# EasyEDA Pro project 智能水杯垫.epro, board 方形
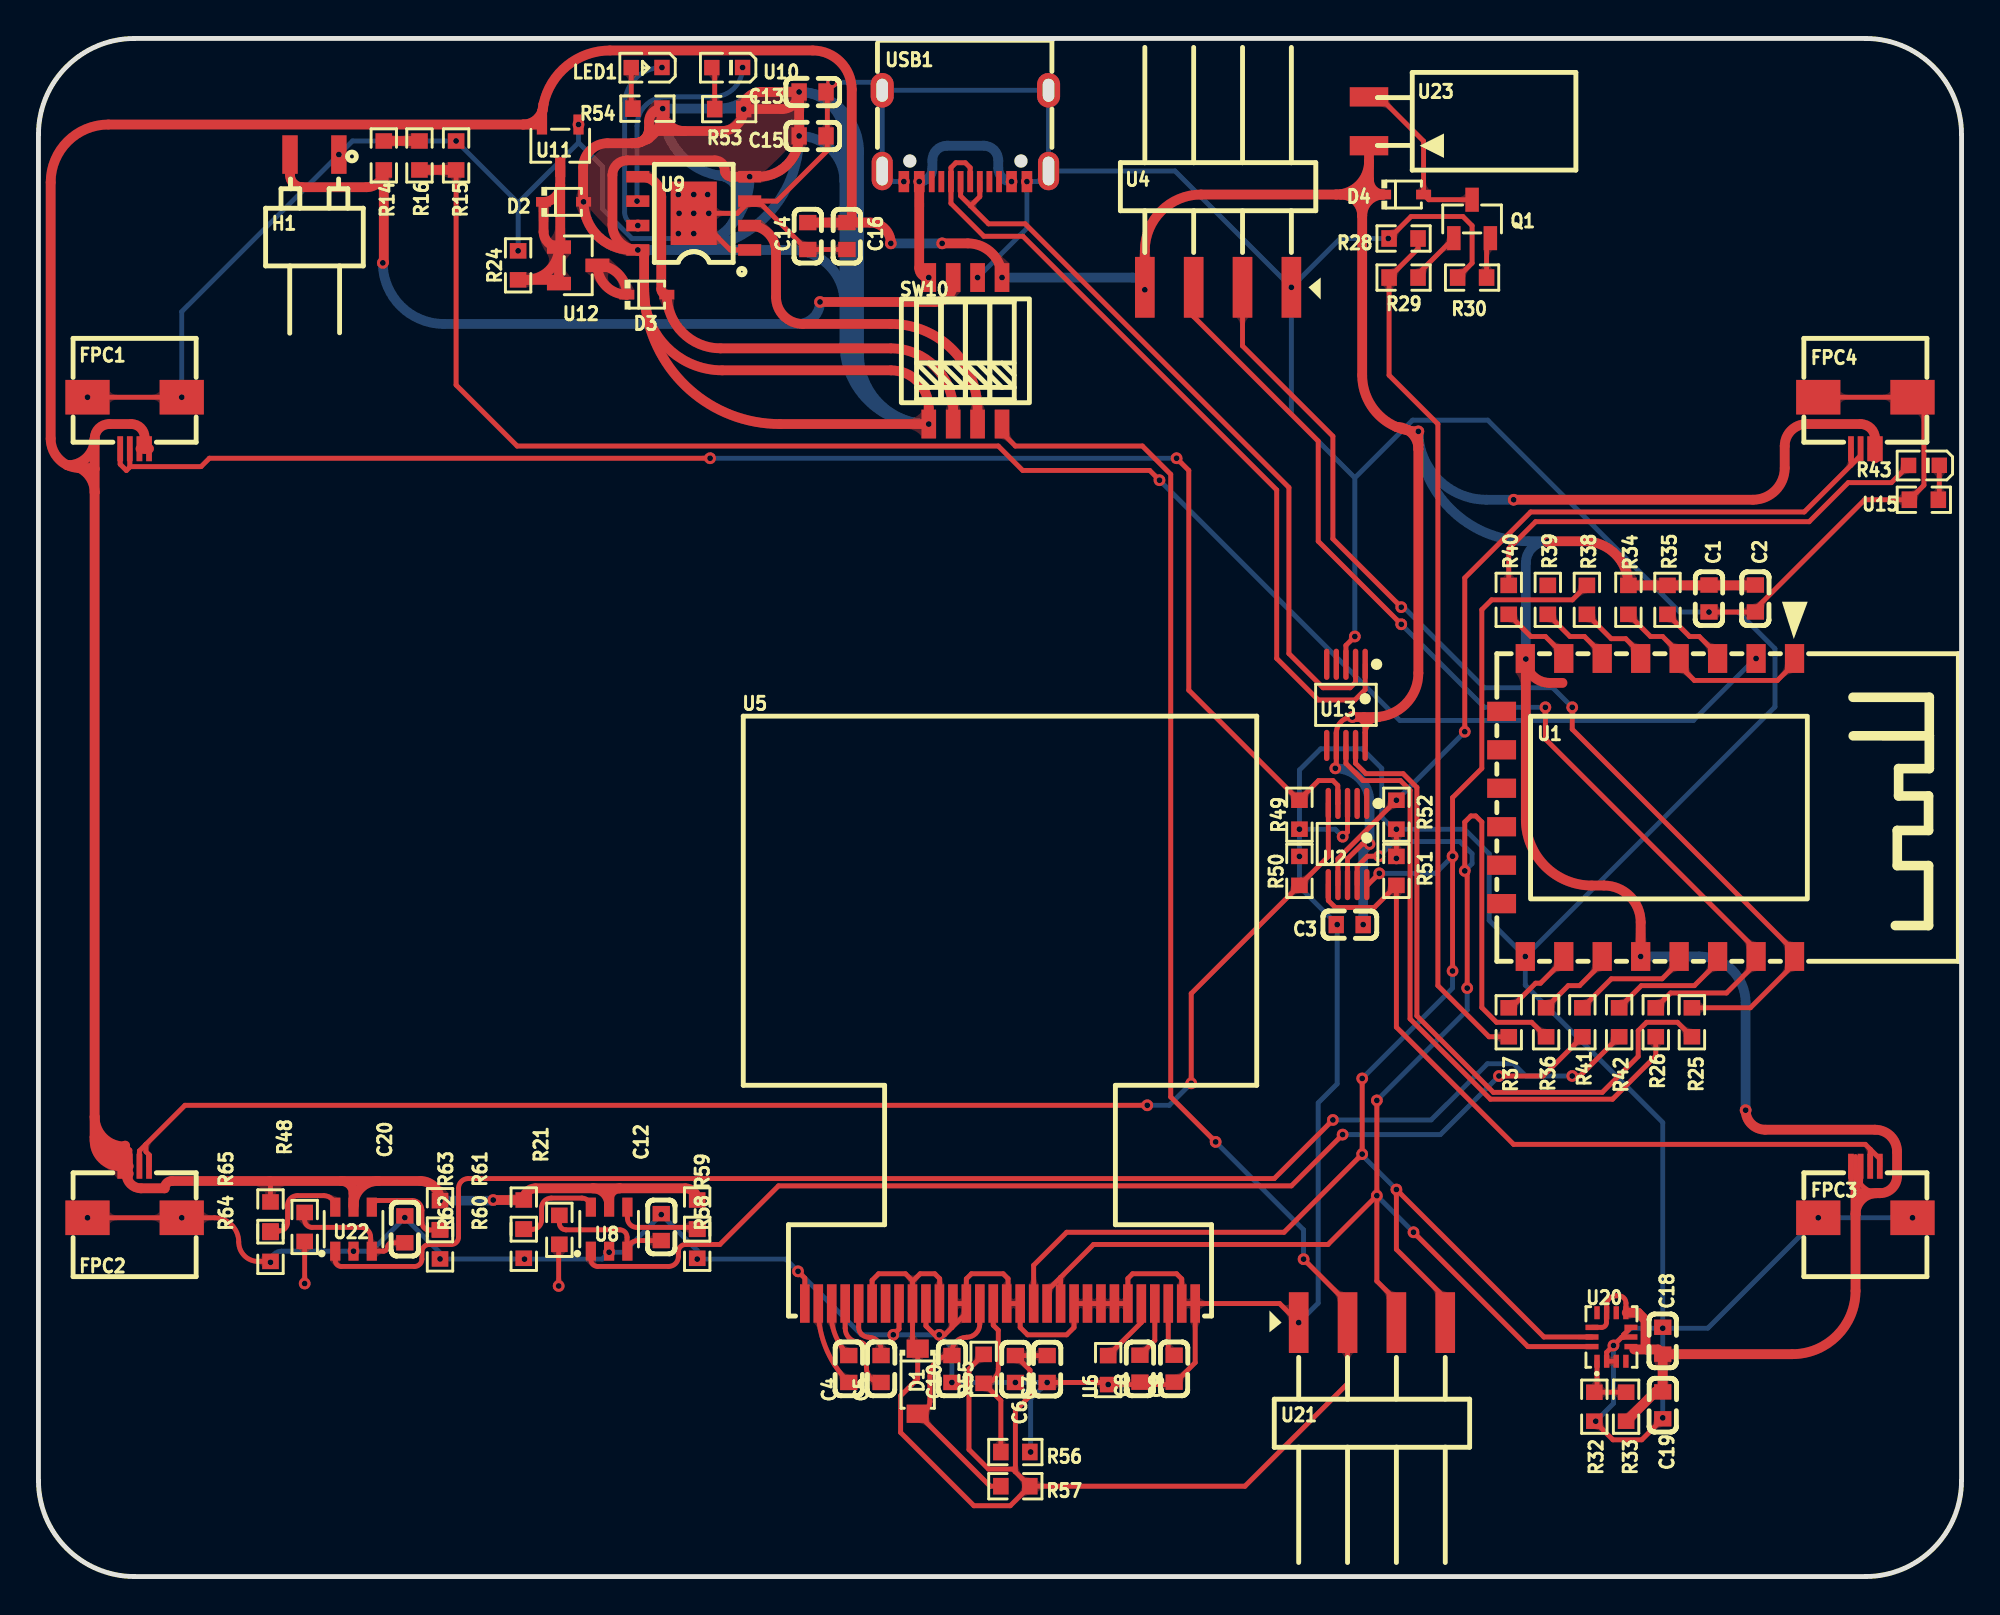
[diagram p4: board, top side]
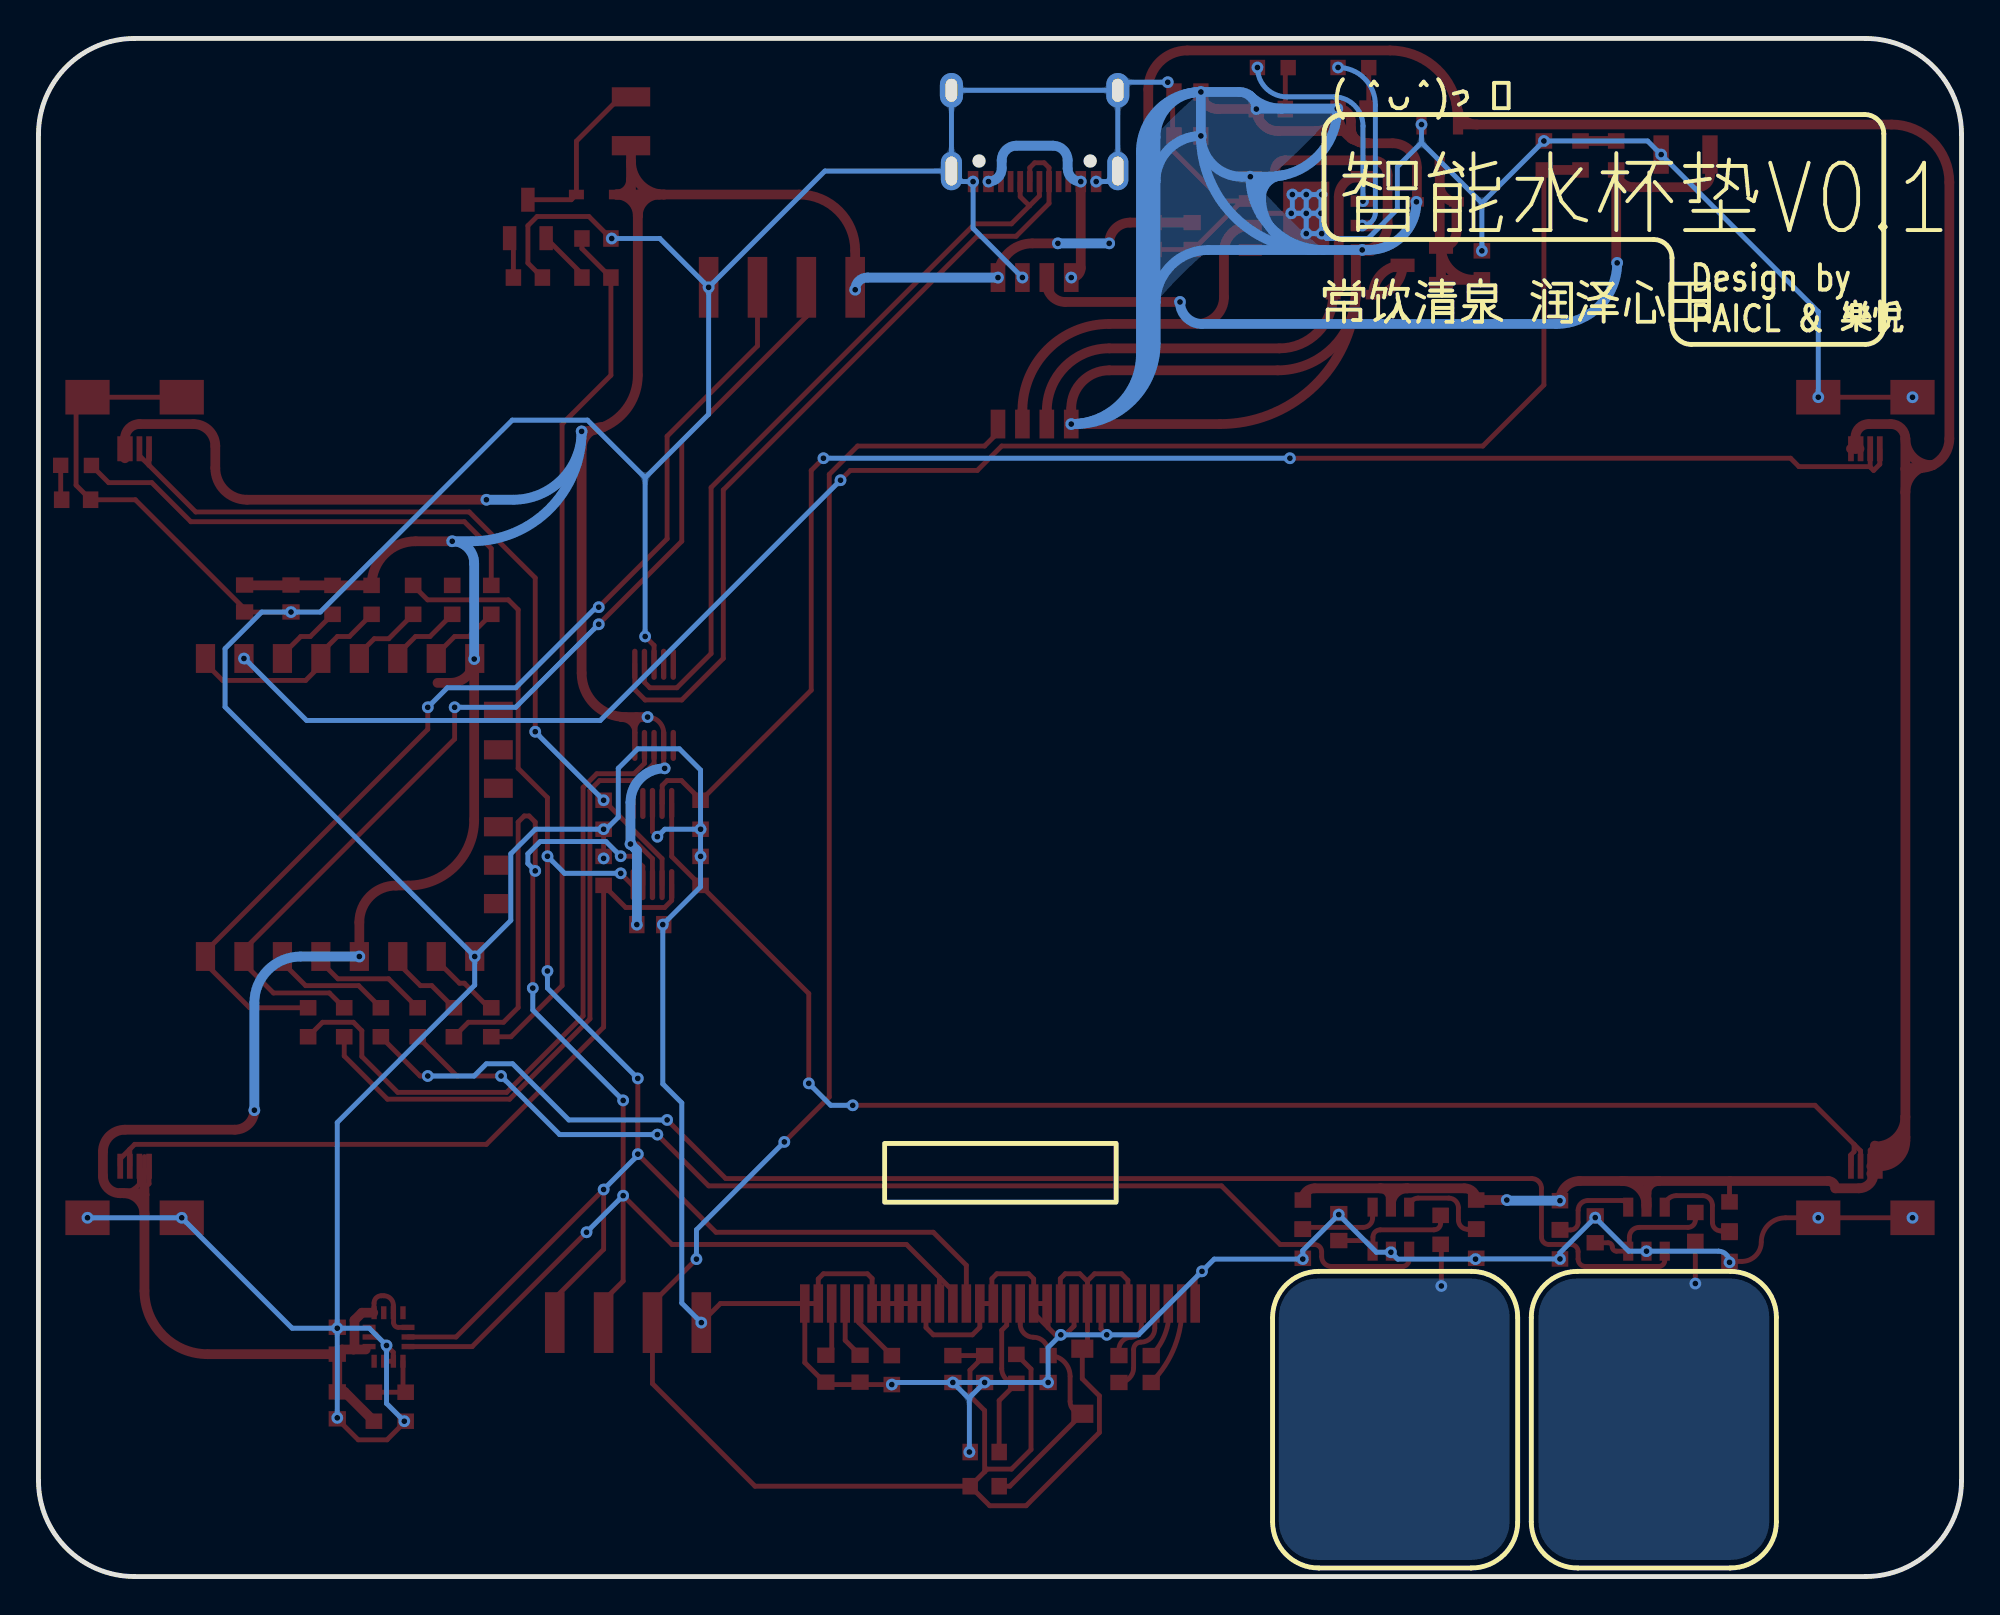
[diagram p5: board, bottom side, seen from below]

Outline 100 x 80 mm; copper layers: Top Layer, Bottom Layer. Coordinates in mm from the lower left corner of the outline.
Outline path: 0,75 0,5 arc(1.46,1.46) 5,0 95,0 arc(98.54,1.46) 100,5 100,75 arc(98.54,78.54) 95,80 5,80 arc(1.46,78.54) 0,75
Stack: Top Layer 0.035mm / Dielectric1 1.51mm FR4 er 4.5 / Bottom Layer 0.035mm

## Design rules (mm)
template: JLCPCB Capability(Two Layers Board)
spacing copperThickness1oz (default): track to track 0.102, other pairs 0.152 to 0.3
spacing copperThickness2oz: track to track 0.203, other pairs 0.152 to 0.3
track width copperThickness1oz (default): min 0.127, default 0.254, max 2.54
track width copperThickness2oz: min 0.203, default 0.254, max 2.54
differential pair differentialPair (default): width min 0.127, default 0.254, max 2.54; gap min 0.152, default 0.152
via viaSize (default): diameter min 0.5, default 0.61, max 10; hole min 0.3, default 0.305, max 6.3

## Placement (name value [footprint] x y rotation side)
C1  10nF  [C0603]  86.87 50.87 90 top
C2  10nF  [C0603]  89.28 50.87 90 top
C3  100nF  [C0603]  68.18 33.91 180 top
C4  1uF  [C0603]  42.14 10.79 270 top
C5  1uF  [C0603]  43.81 10.79 270 top
C6  1uF  [C0603]  50.8 10.79 90 top
C7  1uF  [C0603]  52.45 10.79 90 top
C8  4.7uF  [C0603]  57.28 10.81 90 top
C9  2.2uF  [C0603]  59.06 10.81 90 top
C10  4.7uF  [C0603]  47.5 10.79 270 top
C12  15pF  [C0603]  32.38 18.18 270 top
C13  10uF  [C0603]  40.25 77.22 180 top
C14  10uF  [C0603]  40 69.72 90 top
C15  100nF  [C0603]  40.25 74.93 180 top
C16  100nF  [C0603]  42.04 69.72 90 top
C18  100nF  [C0603]  84.46 12.27 90 top
C19  100nF  [C0603]  84.46 8.9 270 top
C20  15pF  [C0603]  19.05 18.06 270 top
D1  1N4148W  [SOD-123_L2.8-W1.8-LS3.7-RD-1]  45.72 10.16 270 top
D2  B5819WS  [SOD-323_L1.7-W1.3-LS2.5-FD]  27.31 71.5 180 top
D3  B5819WS  [SOD-323_L1.7-W1.3-LS2.5-FD]  31.63 66.67 180 top
D4  B5819WS  [SOD-323_L1.7-W1.3-LS2.5-FD]  70.99 71.88 180 top
FPC1  AFC01-S04FCC-00  [FFC-SMD_4P-P0.50_AFC01-S04FCC-00]  5 60 180 top
FPC2  AFC01-S04FCC-00  [FFC-SMD_4P-P0.50_AFC01-S04FCC-00]  5 20 0 top
FPC3  AFC01-S04FCC-00  [FFC-SMD_4P-P0.50_AFC01-S04FCC-00]  95 20 0 top
FPC4  AFC01-S04FCC-00  [FFC-SMD_4P-P0.50_AFC01-S04FCC-00]  95 60 180 top
H1  MH254RS-11-02-1000  [CONN-SMD_MH254RS-11-02-1000]  14.35 73.96 180 top
LED1  XL-1608SURC-06  [LED0603-RD_RED]  31.62 78.49 180 top
Q1  2N7002K  [SOT-23-3_L2.9-W1.3-P1.90-LS2.4-BR]  74.55 70.61 270 top
R14  10kΩ  [R0603]  17.96 73.91 270 top
R15  10kΩ  [R0603]  21.72 73.91 270 top
R16  10kΩ  [R0603]  19.81 73.91 270 top
R21  0Ω  [R0603]  27.09 18.03 270 top
R24  10kΩ  [R0603]  24.94 68.2 270 top
R25  300Ω  [R0603]  85.98 28.83 270 top
R26  300Ω  [R0603]  84.1 28.83 270 top
R28  10kΩ  [R0603]  70.99 69.6 0 top
R29  1kΩ  [R0603]  70.99 67.56 180 top
R30  0Ω  [R0603]  74.55 67.56 180 top
R32  0Ω  [R0603]  80.91 8.83 270 top
R33  0Ω  [R0603]  82.56 8.83 90 top
R34  10kΩ  [R0603]  82.68 50.8 270 top
R35  10kΩ  [R0603]  84.71 50.8 270 top
R36  22Ω  [R0603]  78.4 28.83 270 top
R37  22Ω  [R0603]  76.45 28.83 270 top
R38  22Ω  [R0603]  80.52 50.8 270 top
R39  22Ω  [R0603]  78.49 50.8 270 top
R40  22Ω  [R0603]  76.45 50.8 270 top
R41  22Ω  [R0603]  80.28 28.83 270 top
R42  22Ω  [R0603]  82.2 28.83 270 top
R43  4.7kΩ  [R0603]  98.04 56.01 180 top
R48  0Ω  [R0603]  13.84 18.18 270 top
R49  4.7kΩ  [R0603]  65.57 39.62 90 top
R50  4.7kΩ  [R0603]  65.57 36.7 270 top
R51  4.7kΩ  [R0603]  70.61 36.7 270 top
R52  4.7kΩ  [R0603]  70.61 39.62 90 top
R53  4.7kΩ  [R0603]  35.92 76.33 0 top
R54  4.7kΩ  [R0603]  31.67 76.35 0 top
R55  4.7kΩ  [R0603]  49.15 10.8 270 top
R56  4.7kΩ  [R0603]  50.8 6.48 180 top
R57  4.7kΩ  [R0603]  50.8 4.7 0 top
R58  4.7kΩ  [R0603]  34.26 17.31 90 top
R59  4.7kΩ  [R0603]  34.25 18.83 90 top
R60  4.7kΩ  [R0603]  25.24 17.31 90 top
R61  4.7kΩ  [R0603]  25.24 18.83 90 top
R62  4.7kΩ  [R0603]  20.88 17.27 90 top
R63  4.7kΩ  [R0603]  20.88 18.8 90 top
R64  4.7kΩ  [R0603]  12.06 17.15 90 top
R65  4.7kΩ  [R0603]  12.06 18.73 90 top
SW10  DSHP04TS-S  [SW-SMD_8P-L6.7-W5.4-P1.27-LS8.5]  48.2 63.75 0 top
U1  2.4GHz  [wifim-smd_esp-f]  83.7 40 270 top
U2  ADS1115IDGSR  [MSOP-10_L3.0-W3.0-P0.50-LS5.0-BL]  68.07 38.1 180 top
U4  X6511WRS-04H-C60D48  [HDR-SMD_4P-P2.54-H-M-W13.3-N]  61.34 67.06 180 top
U5  X096-2864KSWAG01-H30  [LCD-SMD_X096-2864KSWAG01-H30]  50 14.2 0 top
U6  910kΩ  [R0603]  55.63 10.74 90 top
U8  TTP233H-BA6  [SOT-23-6_L2.9-W1.7-P0.95-LS2.8-BL]  29.67 18.07 0 top
U9  TP4056  [ESOP-8_L4.9-W3.9-P1.27-LS6.0-BL-EP]  34.07 70.9 90 top
U10  XL-1608PGC-06  [LED0603-RD_GREEN]  35.81 78.49 180 top
U11  XC6206P332MR  [SOT-23-3_L3.0-W1.7-P0.95-LS2.9-BR]  27.13 74.42 90 top
U12  BSS84  [SOT-23-3_L2.9-W1.3-P1.90-LS2.4-BR-1]  28.07 68.2 180 top
U13  CH340E  [MSOP-10_L3.0-W3.0-P0.50-LS5.0-BL]  67.99 45.34 180 top
U15  XL-1608PGC-06  [LED0603-RD_GREEN]  98.04 57.79 180 top
U20  QMI8658A  [LGA-14_L3.0-W2.5-P0.50-TL]  81.8 12.46 90 top
U21  X6511WRS-04H-C60D48  [HDR-SMD_4P-P2.54-H-M-W13.3-N]  69.34 13.21 0 top
U22  TTP233H-BA6  [SOT-23-6_L2.9-W1.7-P0.95-LS2.8-BL]  16.38 18.07 0 top
U23  X6511FRS-02-C85D30  [HDR-SMD_2P-P2.54-H-F-L11.5]  69.19 75.69 90 top
USB1  TYPE-C 16PIN 2MD(073)  [USB-C-SMD_TYPE-C-6PIN-2MD-073]  48.2 74.93 180 top

## Footprints (pads in the part's own frame, mm; a bottom-side part is the same pattern mirrored in y, then rotated)
C0603
  rect 0.8x0.9 smd: 1(-0.7,0) 2(0.7,0)
CONN-SMD_MH254RS-11-02-1000
  rect 0.8x2 smd: 1(-1.27,0) 2(1.27,0)
ESOP-8_L4.9-W3.9-P1.27-LS6.0-BL-EP
  rect 0.6x1.2 smd: 1(-1.905,-2.909) 2(-0.635,-2.909) 3(0.635,-2.909) 4(1.905,-2.909) 5(1.905,2.909) 6(0.635,2.909) 7(-0.635,2.909) 8(-1.905,2.909)
  rect 3.3x2.4 smd: 9(0,0)
FFC-SMD_4P-P0.50_AFC01-S04FCC-00
  rect 0.3x1.3 smd: 1(-0.75,1.34) 2(-0.25,1.34) 3(0.25,1.34) 4(0.75,1.34)
  rect 2.3x1.8 smd: 5(2.45,-1.34) 6(-2.45,-1.34)
HDR-SMD_2P-P2.54-H-F-L11.5
  rect 1x2 smd: 1(-1.27,0) 2(1.27,0)
HDR-SMD_4P-P2.54-H-M-W13.3-N
  rect 1.02x3.16 smd: 1(-3.81,0) 2(-1.27,0) 3(1.27,0) 4(3.81,0)
LCD-SMD_X096-2864KSWAG01-H30
  rect 0.5x2 smd: 1(-10.15,0) 2(-9.45,0) 3(-8.75,0) 4(-8.05,0) 5(-7.35,0) 6(-6.65,0) 7(-5.95,0) 8(-5.25,0) 9(-4.55,0) 10(-3.85,0) 11(-3.15,0) 12(-2.45,0) 13(-1.75,0) 14(-1.05,0) 15(-0.35,0) 16(0.35,0) 17(1.05,0) 18(1.75,0) 19(2.45,0) 20(3.15,0) 21(3.85,0) 22(4.55,0) 23(5.25,0) 24(5.95,0) 25(6.65,0) 26(7.35,0) 27(8.05,0) 28(8.75,0) 29(9.45,0) 30(10.15,0)
LED0603-RD_GREEN
  rect 0.8x0.8 smd: 1(-0.799,-0.004) 2(0.799,0.004)
LED0603-RD_RED
  rect 0.8x0.8 smd: 1(-0.799,-0.004) 2(0.799,0.004)
LGA-14_L3.0-W2.5-P0.50-TL
  rect 0.675x0.28 smd: 1(-1.262,0.75) 2(-1.262,0.25) 3(-1.262,-0.25) 4(-1.262,-0.75) 8(1.262,-0.75) 9(1.262,-0.25) 10(1.262,0.25) 11(1.262,0.75)
  rect 0.28x0.675 smd: 5(-0.5,-1.012) 6(0,-1.012) 7(0.5,-1.012) 12(0.5,1.012) 13(0,1.012) 14(-0.5,1.012)
MSOP-10_L3.0-W3.0-P0.50-LS5.0-BL
  oval 0.28x1.62 smd: 1(-1,-2.11) 2(-0.5,-2.11) 3(0,-2.11) 4(0.5,-2.11) 5(1,-2.11) 6(1,2.11) 7(0.5,2.11) 8(0,2.11) 9(-0.5,2.11) 10(-1,2.11)
R0603
  rect 0.806x0.864 smd: 1(-0.753,0) 2(0.753,0)
SOD-123_L2.8-W1.8-LS3.7-RD-1
  rect 0.95x1.15 smd: 1(-1.692,0) 2(1.692,0)
SOD-323_L1.7-W1.3-LS2.5-FD
  rect 0.78x0.5 smd: 1(-1.04,0) 2(1.04,0)
SOT-23-3_L2.9-W1.3-P1.90-LS2.4-BR
  rect 1.25x0.7 smd: 1(1,-0.95) 2(1,0.95) 3(-1,0)
SOT-23-3_L2.9-W1.3-P1.90-LS2.4-BR-1
  rect 1.25x0.7 smd: 1(1,-0.95) 2(1,0.95) 3(-1,0)
SOT-23-3_L3.0-W1.7-P0.95-LS2.9-BR
  rect 1.038x0.532 smd: 1(1.101,-0.95) 2(1.101,0.95) 3(-1.101,0)
SOT-23-6_L2.9-W1.7-P0.95-LS2.8-BL
  rect 0.532x0.99 smd: 1(-0.95,-1.145) 2(0,-1.145) 3(0.95,-1.145) 4(0.95,1.145) 5(0,1.145) 6(-0.95,1.145)
SW-SMD_8P-L6.7-W5.4-P1.27-LS8.5
  rect 0.762x1.5 smd: 1(-1.905,-3.81) 2(-0.635,-3.81) 3(0.635,-3.81) 4(1.905,-3.81) 5(1.905,3.81) 6(0.635,3.81) 7(-0.635,3.81) 8(-1.905,3.81)
USB-C-SMD_TYPE-C-6PIN-2MD-073
  rect 0.55x1.1 smd: 1(-3.2,2.375) 2(-2.4,2.375) 11(2.4,2.375) 12(3.2,2.375)
  rect 0.3x1.1 smd: 3(-1.75,2.375) 4(-1.25,2.375) 5(-0.75,2.375) 6(-0.25,2.375) 7(0.25,2.375) 8(0.75,2.375) 9(1.25,2.375) 10(1.75,2.375)
  oval 1.1x2 hole 0.6x1.5: 13(-4.325,1.825) 14(4.325,1.825)
  oval 1.2x1.8 hole 0.6x1.2: 13(-4.325,-2.375) 14(4.325,-2.375)
wifim-smd_esp-f
  rect 1.5x1 smd: 1(-7.75,7.615) 2(-7.75,5.615) 3(-7.75,3.615) 4(-7.75,1.615) 5(-7.75,-0.385) 6(-7.75,-2.385) 7(-7.75,-4.385) 8(-7.75,-6.385) 15(7.75,-6.385) 16(7.75,-4.385) 17(7.75,-2.385) 18(7.75,-0.385) 19(7.75,1.615) 20(7.75,3.615) 21(7.75,5.615) 22(7.75,7.615)
  rect 1x1.5 smd: 9(-5,-7.615) 10(-3,-7.615) 11(-1,-7.615) 12(1,-7.615) 13(3,-7.615) 14(5,-7.615)

## Nets
As in the schematic.

Pads without a net: U1 9 10 11 12 13 14; U2 1 2; U5 7; U13 4 5 6; U20 4 9 11; USB1 3 4 9 10

## Via types
v1: diameter 0.61, hole 0.305, Top Layer to Bottom Layer, 119 vias

## Routing (per net, layer and track width the routed paths; a pad name or vN(x,y) marks a point on that pad's centre or on a via; arc(x,y) is an arc through that point)
GND: length 458.3
  Top Layer w0.254: v1(65.53,13.21) 64.54,14.2 U5.30 ; 37.43,71.54 38.39,71.54 41.02,74.17 41.02,74.86 ; 37.43,71.54 39.94,69.02 C14.1 C16.1 ; 37.43,71.54 U9.3 36.35,70.9 v1(34.86,70.9) ; U2.3 68.07,38.73 v1(67.82,38.48) ; v1(39.5,15.88) 39.85,15.52 U5.1 ; U5.30 U5.29 59.45,15.48 59.18,15.75 56.9,15.75 56.65,15.5 U5.25 U5.24 U5.23 U5.22 U5.21 53.85,14.2 53.85,12.95 53.47,12.57 51.44,12.57 51.05,12.96 U5.17 U5.16 50.42,14.27 50.42,15.49 50.16,15.75 48.51,15.75 48.25,15.48 U5.13 ; U5.30 60.15,11.13 59.13,10.11 C9.1 58.93,9.99 v1(55.63,9.99) 55.52,10.09 v1(52.45,10.09) ; v1(2.55,18.66) v1(7.45,18.66) 9.15,18.66 arc(10.04,18.29) 10.41,17.4 arc(10.71,16.69) 11.42,16.39 R64.1 ; FPC4.5 FPC4.6 98.04,60.75 98.04,56.76 R43.2 94.96,56.01 89.28,50.33 89.28,50.17 89.28,50.17 v1(86.87,50.17) ; R28.1 71.38,70.74 74.07,70.74 74.55,70.26 74.55,68.32 R30.2 ; v1(2.55,61.34) v1(7.45,61.34) ; U5.13 U5.12 47.5,14.15 47.5,12.95 ; U5.13 48.25,13.71 47.5,12.95 ; U5.8 44.75,12.87 v1(44.45,12.57) ; v1(34.07,70.9) 35.98,69 U9.1 ; U20.7 82.42,12.58 82.42,12.45 82.33,12.45 v1(81.9,12.02) 81.55,11.66 U20.2 U20.3 ; 47.5,12.95 47.12,12.57 46.61,12.57 46.15,13.03 U5.10 ; U13.3 67.99,48.43 v1(68.45,48.89) ; C19.2 83.37,7.11 81.87,7.11 R32.2 v1(80.98,8.08) ; 41.02,74.86 C15.1 ; 41.02,74.86 41.02,77.15 C13.1 41.28,77.54 v1(41.28,77.72) ; v1(70.61,38.87) R51.1
  Bottom Layer w0.254: v1(65.57,38.87) 67.43,38.87 v1(67.82,38.48) ; v1(65.57,38.87) v1(65.57,37.46) 65.57,35.87 v1(67.53,33.91) 67.53,25.62 66.55,24.64 66.55,14.22 v1(65.53,13.21) ; v1(65.57,38.87) 65.57,41.95 66.68,43.05 68.83,43.05 69.85,42.04 69.85,39.5 70.48,38.87 v1(70.61,38.87) 74.16,38.87 75.44,37.59 75.44,34.13 v1(77.31,32.25) ; v1(97.45,18.66) v1(92.55,18.66) 86.81,12.92 v1(84.46,12.92) ; 28.08,74.58 29.34,73.33 29.34,71.12 30.86,69.6 33.02,69.6 v1(33.27,69.85) ; 28.08,74.58 24.94,71.44 ; 28.08,74.58 v1(28.08,75.52) ; 24.94,71.44 v1(21.72,74.67) 16.33,74.67 v1(15.62,73.96) 7.45,65.79 v1(7.45,61.34) ; 24.94,71.44 v1(24.94,68.95) ; v1(52.45,10.09) 51.59,9.24 ; v1(52.45,10.09) 55.52,10.09 v1(55.63,9.99) ; v1(52.45,10.09) v1(50.8,10.09) ; 51.59,9.24 v1(51.59,6.48) ; 51.59,9.24 51.59,9.3 v1(50.8,10.09) ; v1(34.07,70.9) v1(34.07,69.85) v1(33.27,69.85) ; v1(34.07,70.9) v1(33.31,70.9) ; v1(34.07,70.9) v1(34.07,71.88) ; v1(34.07,70.9) v1(34.86,70.9) 34.8,70.96 v1(34.8,71.88) v1(34.07,71.88) ; v1(65.15,67.06) 65.15,60.45 68.45,57.15 ; v1(65.15,67.06) 59.1,73.11 USB1.13 ; v1(65.15,67.06) 67.69,69.6 v1(70.19,69.6) ; v1(33.27,69.85) 33.27,70.87 v1(33.31,70.9) ; v1(84.46,12.92) 82.8,12.92 v1(81.9,12.02) 81.9,9 v1(80.98,8.08) ; v1(84.46,12.92) 84.46,23.61 77.31,30.76 v1(77.31,32.25) ; v1(84.46,12.92) v1(84.46,8.25) ; v1(48.84,67.56) 51.4,70.13 v1(51.4,72.56) 51.97,72.56 USB1.13 ; v1(33.31,70.9) 33.31,71.84 v1(33.27,71.88) v1(34.07,71.88) ; v1(68.45,48.89) 68.45,57.15 ; 68.45,57.15 71.45,60.15 75.36,60.15 85.34,50.17 v1(86.87,50.17) 88.39,50.17 90.3,48.26 90.3,45.23 v1(77.31,32.25) ; v1(41.28,77.72) 43.46,77.72 USB1.14 ; USB1.13 USB1.13 USB1.14 ; USB1.14 USB1.14 44.43,72.56 v1(45,72.56) ; v1(50.8,10.09) v1(47.5,10.09) 47.5,11.91 v1(46.84,12.57) v1(44.45,12.57) 42.8,12.57 v1(39.5,15.88) 38.86,16.51 v1(34.26,16.51) 34.26,16.96 v1(32.38,18.83) 30.43,16.87 v1(29.67,16.87) 29.32,16.51 v1(25.27,16.51) 25.26,16.52 v1(20.88,16.52) 20.88,16.84 v1(19.05,18.67) 17.3,16.92 v1(16.38,16.92) 12.64,16.92 arc(12.23,16.75) v1(12.06,16.34)
  vias: v1(70.61,37.35)
VBUS: length 219.5
  Top Layer w0.508: R54.2 32.42,76.11 arc(32.34,75.62) 32.12,75.18 ; R54.2 arc(31.95,76.15) 31.75,75.68 31.75,75.29 ; R54.2 arc(32.76,75.53) 33.59,75.18 ; v1(31.17,69) 30.85,69 arc(29.08,69.73) v1(28.34,71.5) arc(28.33,71.51) 28.32,71.53 28.32,73.28 arc(28.69,74.18) 29.59,74.55 30.86,74.55 ; v1(31.17,69) arc(31.4,68.9) 31.5,68.67 31.5,67.01 ; v1(31.17,69) arc(30.23,69.39) 29.84,70.32 29.84,72.9 arc(30.07,73.44) 30.61,73.66 35.18,73.66 arc(35.54,73.51) 35.69,73.15 arc(35.79,72.91) 36.03,72.81 v1(36.98,72.81) 37.43,72.81 arc(38.93,73.43) v1(39.55,74.93) v1(39.55,77.22) ; 30.86,74.55 31.01,74.55 ; 30.86,74.55 arc(31.09,74.57) 31.32,74.62 ; v1(39.55,77.22) 37.56,77.22 arc(36.93,76.96) v1(36.67,76.33) ; v1(39.55,77.22) arc(39.29,76.59) 38.66,76.33 v1(36.67,76.33) ; 32.12,75.18 32.06,75.18 arc(31.89,75.15) 31.75,75.05 ; 32.12,75.18 33.59,75.18 ; 32.12,75.18 arc(31.94,74.99) 31.74,74.82 ; 31.01,74.55 arc(31.17,74.57) 31.32,74.62 ; 31.01,74.55 arc(31.17,74.57) 31.32,74.62 ; v1(36.67,76.33) arc(36.34,75.52) 35.53,75.18 33.59,75.18 ; 31.75,75.29 31.75,75.05 ; 31.75,75.29 arc(31.63,74.89) 31.32,74.62 ; 31.75,75.29 arc(31.63,74.89) 31.32,74.62 ; 31.75,75.05 31.75,74.87 arc(31.75,74.85) 31.74,74.82 ; 31.75,75.05 arc(31.66,74.91) 31.63,74.75 ; 31.5,67.01 31.5,66.8 arc(31.51,66.48) 31.55,66.16 ; 31.5,67.01 arc(31.51,66.58) 31.55,66.16 ; 31.55,66.16 arc(32.92,63.71) 35.56,62.74 44.32,62.74 arc(45.72,62.16) 46.29,60.77 v1(46.29,59.94) 38.56,59.94 arc(33.87,61.72) 31.55,66.16 ; 31.32,74.62 arc(31.48,74.68) 31.63,74.75 ; 31.74,74.82 arc(31.69,74.77) 31.63,74.75 ; 31.74,74.82 arc(31.68,74.78) 31.63,74.75
  Bottom Layer w0.508: 41.91,72.57 41.91,74.86 arc(41.22,76.53) v1(39.55,77.22) ; 41.91,72.57 41.91,66.25 ; 41.91,72.57 arc(41.22,74.24) v1(39.55,74.93) ; 41.91,66.25 41.91,64.14 arc(43.14,61.17) 46.1,59.94 v1(46.29,59.94) ; 41.91,66.25 arc(41.11,68.19) 39.16,69 33.71,69 ; 35.37,76.35 v1(32.46,76.35) arc(33.25,74.12) 35.26,72.89 ; 35.37,76.35 36.65,76.35 arc(36.66,76.34) v1(36.67,76.33) arc(36.73,76.64) 36.89,76.92 ; 35.37,76.35 arc(36.18,76.5) 36.89,76.92 ; 33.17,69 v1(31.17,69) 30.85,69 arc(29.08,69.73) v1(28.34,71.5) ; 33.17,69 33.62,69 ; 33.17,69 arc(34.72,69.33) 36,70.25 ; 36,72.81 v1(36.98,72.81) ; 36,72.81 arc(36.41,72.64) 36.58,72.23 36.58,71.88 ; 36,72.81 arc(35.81,72.81) 35.63,72.83 ; v1(36.98,72.81) 37.43,72.81 arc(38.93,73.43) v1(39.55,74.93) ; v1(36.98,72.81) arc(36.84,71.78) 36.43,70.83 ; 36.43,71.72 36.43,70.83 ; 36.43,71.72 arc(36.32,70.96) 36,70.25 ; 36.43,71.72 arc(36.21,72.41) 35.63,72.83 ; 36.43,70.83 arc(36.23,70.53) 36,70.25 ; 33.62,69 33.71,69 ; 33.62,69 arc(33.75,69) 33.88,69 ; v1(39.55,77.22) v1(39.55,74.93) ; v1(39.55,77.22) 37.56,77.22 arc(37.27,77.17) 37.02,77.03 ; v1(39.55,77.22) arc(41.76,76.3) 42.67,74.1 42.67,63.57 arc(43.73,61.01) v1(46.29,59.94) ; v1(39.55,77.22) arc(41.49,76.41) 42.29,74.48 42.29,63.95 arc(43.46,61.12) v1(46.29,59.94) ; v1(39.55,74.93) arc(37.91,70.83) 33.88,69 ; 33.71,69 arc(33.79,69) 33.88,69 ; 36,70.25 arc(35.09,69.38) 33.88,69 ; 37.02,77.03 arc(36.95,76.98) 36.89,76.92 ; 37.02,77.03 arc(36.96,76.97) 36.89,76.92 ; 35.26,72.89 arc(35.45,72.87) 35.63,72.83 ; 35.26,72.89 arc(35.44,72.85) 35.63,72.83
VCC: length 412.8
  Top Layer w0.254: 94.49,20.19 94.25,20.43 FPC3.1 ; 94.49,20.19 94.49,21.18 ; 94.49,20.19 94.73,20.44 ; v1(69.22,38.1) 68.84,38.1 68.07,37.33 U2.8 ; 94.74,20.45 94.73,20.44 ; 94.74,20.45 94.75,20.46 FPC3.2 ; 94.74,20.45 arc(94.55,20.79) 94.49,21.18 ; 94.73,20.44 arc(94.55,20.79) 94.49,21.18 ; 94.73,20.44 arc(95.17,20.07) 95.73,19.94 ; FPC2.2 4.75,22.17 4.51,22.42 4.25,22.16 4.25,21.78 ; R65.2 12.06,20.55 arc(12.06,20.57) 12.04,20.57 ; 94.49,21.18 94.49,21.84 ; U20.12 81.29,12.96 arc(81.46,13.03) 81.53,13.21 81.53,13.71 arc(81.54,13.72) U20.10 81.55,14.11 arc(81.69,14.46) 82.04,14.6 82.17,14.6 arc(82.44,14.49) 82.55,14.22 82.55,13.73 arc(82.55,13.72) U20.8 ; FPC4.1 FPC4.2 ; U13.10 68.99,43.89 ; 68.99,43.89 68.99,44.04 ; 68.99,43.89 arc(69.19,44.38) 69.67,44.58 69.72,44.58 ; v1(67.44,42.04) 67.49,42.09 U13.7 67.49,43.87 arc(67.73,44.46) v1(68.33,44.7) arc(68.79,44.51) 68.99,44.04 ; 68.99,44.04 68.99,44.64 arc(68.97,44.68) 68.92,44.7 ; FPC1.2 5.31,58.66
  Top Layer w0.508: 69.19,73.6 69.19,72.64 ; 69.19,73.6 U23.1 ; 69.19,73.6 arc(68.69,72.38) 67.47,71.88 ; 69.19,72.64 69.19,71.93 arc(69.2,71.89) 69.23,71.88 ; 69.19,72.64 arc(69.41,72.1) D4.2 ; FPC2.1 4.46,21.34 ; FPC2.1 4.25,21.78 arc(4.08,22.19) 3.68,22.35 ; FPC2.1 arc(3.31,21.73) 2.92,22.67 2.92,22.86 ; 4.46,21.34 4.69,21.34 ; 4.46,21.34 4.46,22.37 ; 28.83,20.19 25.85,20.19 arc(25.41,20.01) R61.2 v1(23.65,19.58) ; 28.83,20.19 30.23,20.19 ; 28.83,20.19 arc(29.43,19.95) 29.67,19.35 ; 2.92,56.39 2.92,23.91 ; 2.92,56.39 2.92,57.61 ; 2.92,56.39 arc(2.71,57.14) 2.13,57.66 ; 2.92,23.91 2.92,22.86 ; 2.92,23.91 arc(3.37,22.82) 4.46,22.37 ; v1(78.49,53.85) 80.38,53.85 arc(82,53.18) R34.1 R35.1 89.26,51.55 arc(89.28,51.56) C2.2 ; 16.38,19.3 16.38,19.94 arc(16.2,20.39) 15.75,20.57 ; 16.38,19.3 U22.5 ; 16.38,19.3 arc(16.75,20.2) 17.65,20.57 ; v1(57.53,66.93) 57.53,68.96 arc(58.39,71.03) 60.45,71.88 67.47,71.88 ; 17.65,20.57 19.86,20.57 arc(20.58,20.27) v1(20.88,19.55) ; 17.65,20.57 15.75,20.57 ; 1.51,57.8 1.54,57.8 arc(2.52,58.21) 2.92,59.18 ; 1.51,57.8 arc(1.83,57.77) 2.13,57.66 ; 1.51,57.8 arc(0.87,58.36) 0.64,59.18 0.64,72.52 arc(1.52,74.64) 3.64,75.52 25.2,75.52 ; 1.51,57.8 arc(1.81,57.7) 2.13,57.66 ; C18.1 91.2,11.57 arc(93.52,12.53) 94.49,14.86 94.49,18.85 ; C18.1 C19.1 84.08,9.6 R33.1 ; C18.1 84.22,11.81 83.62,11.81 ; 67.72,71.88 68.8,71.88 ; 67.72,71.88 67.47,71.88 ; 67.72,71.88 arc(68.51,71.56) 68.83,70.77 ; 68.8,71.88 69.23,71.88 ; 68.8,71.88 arc(68.82,71.87) 68.83,71.85 68.83,70.77 ; C16.2 43.24,70.42 arc(44.01,70.11) v1(44.32,69.34) ; C16.2 C14.2 ; C16.2 arc(42.22,70.5) 42.29,70.68 42.29,77.34 arc(41.7,78.78) 40.26,79.38 29.72,79.38 arc(27.5,78.59) 26.26,76.58 ; U8.5 29.67,19.35 ; 29.67,19.35 29.67,19.64 arc(29.84,20.03) 30.23,20.19 ; 15.75,20.57 6.94,20.57 arc(6.67,20.46) 6.56,20.19 5.33,20.19 arc(4.8,20.42) 4.57,20.96 4.69,20.96 ; 69.23,71.88 D4.2 ; 25.2,75.52 U11.2 26.18,75.84 arc(26.19,76.04) 26.21,76.24 ; 25.2,75.52 arc(25.82,75.72) 26.21,76.24 ; 4.46,22.37 arc(4.48,22.4) 4.51,22.42 ; 30.23,20.19 33.64,20.19 arc(34.07,20.01) R59.2 ; 68.83,70.77 68.83,62.48 arc(69.32,60.88) 70.6,59.8 ; 68.83,70.77 arc(69.16,71.56) D4.2 ; 95.5,58.17 95.5,59.18 arc(95.28,59.72) 94.74,59.94 91.95,59.94 arc(91.14,59.61) 90.81,58.8 90.81,57.66 arc(90.32,56.49) 89.15,56.01 v1(76.71,56.01) ; 94.49,18.85 94.49,19.86 ; 94.49,18.85 arc(94.81,19.62) 95.58,19.94 ; 94.49,19.86 94.49,20.19 ; 94.49,19.86 arc(94.51,19.92) 94.57,19.94 95.58,19.94 ; 95.58,19.94 95.76,19.94 arc(96.39,20.2) 96.65,20.83 96.65,22.1 arc(96.31,22.91) 95.5,23.24 89.79,23.24 arc(89.07,23.54) v1(88.77,24.26) ; 2.92,22.86 arc(3.22,22.14) 3.94,21.84 arc(3.49,22.03) 3.3,22.48 3.3,22.61 ; v1(68.33,44.7) 69.47,44.7 arc(71.09,45.37) 71.75,46.99 71.75,58.65 ; 2.92,57.61 2.92,59.18 ; 2.92,57.61 arc(2.91,57.65) 2.88,57.66 2.16,57.66 arc(2.15,57.66) 2.13,57.66 ; 2.92,59.18 arc(3.14,59.72) 3.68,59.94 4.83,59.94 arc(5.32,59.74) 5.52,59.25 5.52,58.66 ; FPC1.1 5.52,58.66 ; 5.52,58.66 5.31,58.66 ; 71.75,58.85 v1(71.75,59.56) arc(71.52,59.57) 71.29,59.6 ; 71.75,58.85 71.75,58.65 ; 71.75,58.85 arc(71.63,59.29) 71.29,59.6 ; v1(46.99,69.34) 48.33,69.34 arc(49.58,68.82) v1(50.1,67.56) ; 71.75,58.65 arc(71.62,59.19) 71.24,59.61 ; 83.62,11.81 83.57,11.86 83.57,13.34 83.18,13.72 82.59,13.72 ; 83.62,11.81 82.98,11.81 ; 79.25,46.48 78.58,46.48 arc(77.71,46.85) v1(77.34,47.72) ; v1(77.34,47.72) 77.34,39.37 arc(78.35,36.95) 80.77,35.94 81.41,35.94 arc(82.76,35.38) 83.31,34.03 v1(83.31,32.25) ; v1(77.34,47.72) arc(77.33,47.74) U1.8 ; 71.24,59.61 arc(71.21,59.63) 71.19,59.64 ; 71.24,59.61 arc(71.08,59.64) 70.92,59.68 ; 71.24,59.61 arc(71.26,59.61) 71.29,59.6 ; 71.19,59.64 arc(70.9,59.76) 70.6,59.8 ; 71.19,59.64 arc(71.24,59.62) 71.29,59.6 ; 71.19,59.64 arc(71.06,59.67) 70.92,59.68 ; 70.92,59.68 arc(70.76,59.74) 70.6,59.8 ; 26.21,76.24 arc(26.25,76.41) 26.26,76.58 ; 26.21,76.24 arc(26.23,76.41) 26.26,76.58
  Bottom Layer w0.508: v1(20.88,19.55) 23.61,19.55 arc(23.64,19.56) v1(23.65,19.58) ; v1(68.88,33.91) 68.88,37.77 v1(69.22,38.1) 69.22,40.26 arc(68.69,41.52) v1(67.44,42.04) ; v1(76.71,56.01) 75.31,56.01 arc(72.8,57.05) v1(71.75,59.56) arc(73.43,55.52) 77.47,53.85 v1(78.49,53.85) arc(77.68,53.51) 77.34,52.7 v1(77.34,47.72) ; v1(83.31,32.25) 86.37,32.25 arc(88.07,31.55) 88.77,29.84 v1(88.77,24.26) ; v1(44.32,69.34) v1(46.99,69.34) ; v1(50.1,67.56) 56.9,67.56 arc(57.35,67.38) v1(57.53,66.93)
/TOUCH_PIN0: length 2.2
  Top Layer w0.254: v1(27.05,15.11) 27.05,17.25 R21.2
/TOUCH_PIN1: length 2.2
  Top Layer w0.254: R48.2 v1(13.84,15.24)
BAT_ADC: length 89.2
  Top Layer w0.254: v1(58.29,57.02) 57.78,57.53 51.18,57.53 49.91,58.8 24.89,58.8 21.72,61.98 R15.2
  Top Layer w0.508: R16.2 R15.2
  Bottom Layer w0.254: 89.28,47.75 86.06,44.53 70.79,44.53 v1(58.29,57.02)
  vias: v1(89.31,47.75)
BAT_VCC: length 26.1
  Top Layer w0.508: 31.17,72.81 31.33,72.81 arc(32.08,72.5) 32.38,71.75 32.38,66.96 arc(32.47,66.76) D3.1 arc(33.49,64.7) 35.47,63.88 44.32,63.88 arc(46.62,62.93) 47.56,60.64 SW10.2
CH340_RX: length 35.1
  Top Layer w0.254: R25.2 85.23,28.83 83.62,28.83 83.19,28.39 83.19,27.05 81.32,25.18 75.65,25.18 71.68,29.16 71.68,41.04 70.97,41.76 69.03,41.76 68.49,42.3 U13.9
CH340_TX: length 33.2
  Top Layer w0.254: R26.2 84.1,27.08 81.85,24.83 75.5,24.83 71.32,29.01 71.32,40.9 70.82,41.4 68.88,41.4 67.99,42.29 U13.8
D+: length 42.7
  Top Layer w0.254: USB1.6 48.45,73.28 48.2,73.53 47.7,73.53 47.45,73.28 USB1.8 47.45,71.42 49.16,69.71 51.19,69.71 64.39,56.52 64.39,47.75 66.55,45.59 68.45,45.59 68.99,46.13 U13.1
D-: length 39.5
  Top Layer w0.254: 48.47,71.29 49.4,70.36 51.31,70.36 65.02,56.64 65.02,48.01 66.8,46.23 68.21,46.23 68.49,46.51 U13.2 ; 48.47,71.29 48.95,71.77 USB1.5 ; 48.47,71.29 47.95,71.81 USB1.7
IIC_SCL: length 87.3
  Top Layer w0.254: v1(68.83,25.91) v1(68.83,21.97) 64.77,17.91 53.47,17.91 51.75,16.19 U5.18 ; U21.4 73.15,14.48 70.61,17.02 v1(70.61,20.13) 78.28,12.46 U20.13 ; U2.10 69.14,35.99 v1(69.72,36.58) ; R38.1 79.76,50.8 75.56,50.8 75.06,50.29 75.06,42.04 73.53,40.51 v1(73.53,37.47) v1(73.53,31.5)
  Bottom Layer w0.254: v1(70.61,20.13) 68.83,21.91 v1(68.83,21.97) ; v1(73.53,31.5) 73.53,30.61 v1(68.83,25.91) ; v1(69.72,36.58) 72.64,36.58 v1(73.53,37.47)
IIC_SDA: length 87.6
  Top Layer w0.254: v1(74.29,30.61) 74.29,36.58 v1(74.17,36.7) 74.17,39.24 74.49,39.56 74.74,39.56 75.06,39.24 75.06,29.59 75.82,28.83 77.64,28.83 R36.2 ; v1(69.6,19.81) 67.06,17.27 54.86,17.27 53.15,15.56 ; v1(69.6,19.81) v1(69.6,24.77) ; v1(69.6,19.81) 69.6,15.37 70.61,14.35 U21.3 ; v1(69.72,37.47) 69.11,37.47 68.57,36.93 U2.9 ; U5.19 52.45,14.86 53.15,15.56 ; U5.20 53.15,15.56 ; U20.14 77.45,11.96 v1(71.5,17.91)
  Bottom Layer w0.254: v1(69.72,37.47) 70.49,38.23 73.91,38.23 74.55,37.59 74.55,37.08 v1(74.17,36.7) ; v1(71.5,17.91) v1(69.6,19.81) ; v1(74.29,30.61) 74.29,29.46 v1(69.6,24.77)
IN_BAT_VCC: length 44.7
  Top Layer w0.508: v1(40.64,66.29) 46.61,66.29 arc(47.28,66.57) 47.56,67.25 SW10.7 ; H1.2 13.08,72.9 arc(13.27,72.45) 13.72,72.26 17.06,72.26 arc(17.69,72.53) R14.2 17.96,68.38 arc(17.94,68.34) v1(17.91,68.33)
  Bottom Layer w0.508: v1(40.64,66.29) arc(40.31,65.49) 39.5,65.15 21.08,65.15 arc(18.84,66.08) v1(17.91,68.33)
IN_VBUS: length 12.6
  Top Layer w0.508: v1(45.8,72.56) 45.8,68.06 arc(45.94,67.71) v1(46.29,67.56)
  Bottom Layer w0.508: v1(45.8,72.56) arc(46.28,72.75) 46.48,73.24 46.48,73.66 arc(46.71,74.2) 47.24,74.42 49.15,74.42 arc(49.69,74.2) 49.91,73.66 49.91,73.24 arc(50.11,72.76) v1(50.6,72.56)
IO4/TOUCH_CTRL_PIN: length 57.4
  Top Layer w0.254: R41.2 78.24,26.03 v1(75.95,26.03) ; v1(67.82,22.99) 65.15,20.32 38.48,20.32 35.43,17.27 33.66,17.27 arc(33.39,17.16) 33.27,16.89 33.27,16.64 arc(33.13,16.28) 32.77,16.13 29.08,16.13 arc(28.83,16.23) 28.72,16.49 U8.1
  Bottom Layer w0.254: v1(67.82,22.99) 72.9,22.99 v1(75.95,26.03)
IO5/TOUCH_CTRL_PIN: length 74.9
  Top Layer w0.254: U22.1 15.43,16.44 arc(15.53,16.22) 15.75,16.13 19.56,16.13 arc(19.83,16.24) 19.94,16.51 19.94,16.89 arc(20.05,17.16) 20.32,17.27 21.46,17.27 arc(21.73,17.38) 21.84,17.65 21.84,20.19 arc(21.99,20.55) 22.35,20.7 64.26,20.7 v1(67.31,23.75) ; R42.2 80.16,26.03 v1(79.76,26.03)
  Bottom Layer w0.254: v1(67.31,23.75) 72.42,23.75 75.34,26.67 76.71,26.67 77.34,26.03 v1(79.76,26.03)
IO13/PWM: length 24.5
  Top Layer w0.254: R40.1 76.45,53.47 77.85,54.86 92.07,54.86 94.11,56.9 96.35,56.9 U15.2
IO15/MOTOR: length 45.3
  Top Layer w0.254: R28.2 71.74,69.07 R29.2 70.23,62.48 72.77,59.94 72.77,30.73 75.43,28.08 R37.2
OLED_VCC: length 121.2
  Top Layer w0.254: R55.1 48.39,10.79 48.39,6.6 49.4,5.59 50.66,5.59 50.8,5.45 ; U5.6 43.35,15.41 43.69,15.75 45.09,15.75 45.45,15.38 45.45,15.35 ; 51.55,4.7 62.74,4.7 68.07,10.03 U21.2 68.07,14.22 v1(65.79,16.51) ; 51.55,4.7 50.53,3.68 48.64,3.68 44.83,7.49 44.83,9.4 45.72,10.29 D1.1 arc(45.53,11.93) 45.45,12.12 U5.9 45.45,15.35 ; 51.55,4.7 50.8,5.45 ; SW10.4 50.1,59.5 50.8,58.8 57.4,58.8 58.88,57.33 58.88,24.94 v1(61.21,22.61) ; 45.45,15.35 45.85,15.75 46.61,15.75 46.86,15.49 46.86,14.21 U5.11 ; 50.8,5.45 50.8,8.64 51.56,9.4 51.56,10.73 50.8,11.5 52.45,11.5
  Bottom Layer w0.254: v1(61.21,22.61) 65.79,18.03 v1(65.79,16.51)
PROG: length 19.1
  Top Layer w0.508: 48.84,59.94 48.84,60.64 arc(47.51,63.83) 44.32,65.15 39.75,65.15 arc(38.76,65.56) 38.35,66.55 38.35,68.9 arc(37.95,69.87) U9.2
RI0: length 81
  Top Layer w0.254: FPC1.4 4.25,57.85 4.57,57.53 4.75,57.71 ; v1(59.18,58.17) 59.82,57.53 59.82,46.1 65.54,40.38 ; 4.75,57.71 4.77,57.73 8.45,57.73 8.89,58.17 v1(34.93,58.17) ; 4.75,57.71 FPC1.3 ; 65.54,40.38 66.57,41.4 67.31,41.4 67.56,41.15 67.56,40.22 U2.4 ; 65.54,40.38 R49.2
  Bottom Layer w0.254: v1(34.93,58.17) v1(59.18,58.17)
RI1: length 75.7
  Top Layer w0.254: v1(57.66,24.51) 7.62,24.51 5.59,22.48 ; 5.59,22.48 5.59,22.1 5.75,21.94 FPC2.4 ; 5.59,22.48 5.25,22.14 FPC2.3 ; v1(59.94,25.65) 59.94,30.32 R50.2 67.07,37.45 U2.5
  Bottom Layer w0.254: v1(57.66,24.51) 58.8,24.51 v1(59.94,25.65)
RI2: length 41.6
  Top Layer w0.254: 95.25,22.22 95,22.48 76.71,22.48 70.61,28.58 R51.2 69.46,34.8 67.44,34.8 67.07,35.16 U2.6 ; 95.25,22.22 95.75,21.72 FPC3.4 ; 95.25,22.22 FPC3.3
RI3: length 43.1
  Top Layer w0.254: 94.25,57.8 94.75,58.3 FPC4.3 ; 94.25,57.8 FPC4.4 ; 94.25,57.8 91.82,55.37 77.6,55.37 74.17,51.94 v1(74.17,43.94) ; U2.7 67.57,37.34 v1(70.61,40.38)
  Bottom Layer w0.254: v1(70.61,40.38) 74.17,43.93 v1(74.17,43.94)
RX_D: length 55.3
  Top Layer w0.254: R26.1 84.87,30.35 87.78,30.35 89.28,31.86 89.28,32.22 U1.21 89.31,32.61 78.36,43.56 v1(78.36,45.21) ; U4.3 60.07,65.53 66.55,59.06 66.55,53.85 v1(70.87,49.53)
  Bottom Layer w0.254: v1(70.87,49.53) 75.18,45.21 v1(78.36,45.21)
TX_D: length 55.5
  Top Layer w0.254: v1(79.76,45.21) 79.76,44.07 91.31,32.51 91.31,32.25 ; 91.31,32.25 91.31,31.88 89.02,29.58 R25.1 ; 91.31,32.25 U1.22 ; v1(70.87,50.42) 67.31,53.97 67.31,59.31 62.61,64.01 U4.2
  Bottom Layer w0.254: v1(79.76,45.21) 78.74,46.23 75.18,46.23 70.99,50.42 v1(70.87,50.42)
$1N6131: length 4.5
  Top Layer w0.254: C4.2 arc(40.91,11.98) U5.2
$1N6135: length 3
  Top Layer w0.254: 42.14,11.5 arc(41.37,12.74) U5.3
$1N6207: length 5.2
  Top Layer w0.254: U5.4 41.95,12.91 arc(42.16,12.4) 42.67,12.19 arc(42.94,12.08) 43.05,11.81 43.05,10.86 arc(43.28,10.32) C5.2
$1N6245: length 3.4
  Top Layer w0.254: U5.5 42.65,12.98 arc(42.81,12.6) 43.18,12.45 arc(43.63,12.26) 43.81,11.81 43.81,11.5
$1N6748: length 3.4
  Top Layer w0.254: U5.26 57.35,13.22 U6.2
$1N6861: length 3
  Top Layer w0.254: C8.2 58.05,12.28 U5.27
$1N6934: length 2.8
  Top Layer w0.254: C9.2 58.75,11.82 U5.28
$1N7057: length 13.5
  Top Layer w0.254: R57.1 49.49,4.7 D1.2 arc(46.17,8.65) 46.35,9.1 46.35,10.41 arc(46.67,11.18) 47.44,11.5 47.5,11.5 47.5,11.68 arc(47.72,12.22) 48.26,12.45 arc(48.75,12.65) 48.95,13.14 U5.14
$1N7351: length 8.8
  Top Layer w0.254: R56.2 50.04,9.15 49.15,10.05 arc(49.69,10.27) 49.91,10.81 49.91,12.81 49.65,13.07 U5.15 arc(49.65,14.2) 49.66,14.19 49.74,14.11
$1N8175: length 3.7
  Top Layer w0.254: U1.3 87.31,47.94 86.36,48.89 85.86,48.89 R35.2
$1N8529: length 1.9
  Top Layer w0.508: R14.1 R16.1
$1N8683: length 4.5
  Top Layer w0.254: U8.4 30.62,18.65 arc(30.77,18.3) 31.12,18.16 34.17,18.16 arc(34.23,18.14) R59.1
$1N8688: length 5
  Top Layer w0.254: R60.2 25.68,18.06 arc(26.02,18.2) 26.16,18.54 26.16,19.18 arc(26.31,19.54) 26.67,19.69 28.25,19.69 arc(28.59,19.55) U8.6
$1N8917: length 7.2
  Top Layer w0.254: R21.1 27.09,18.38 arc(27.19,18.14) 27.43,18.03 30.23,18.03 arc(30.5,17.92) 30.61,17.65 30.61,16.94 arc(30.61,16.93) U8.3 arc(30.79,17.31) 31.18,17.48 C12.2
$1N11483: length 9.7
  Bottom Layer w0.254: v1(32.42,78.49) arc(31.05,77.92) 30.48,76.55 30.48,70.96 arc(30.68,70.47) v1(31.17,70.27)
$1N11695: length 11.1
  Bottom Layer w0.254: v1(31.12,71.54) 31.12,75.45 arc(31.57,76.52) 32.64,76.96 35.09,76.96 arc(36.17,77.41) v1(36.61,78.49)
$1N15528: length 4.8
  Top Layer w0.508: 30.59,66.67 30.59,66.67 arc(29.51,67.12) U12.3 29.07,68.2 arc(30.15,67.75) 30.59,66.67
$1N15646: length 15.2
  Top Layer w0.508: U12.1 U12.2 arc(27.01,67.39) 26.87,67.45 25.36,67.45 ; U12.1 arc(27.11,69.17) 27.13,69.21 27.13,72.37 ; U12.1 arc(26.5,69.38) 26.27,69.95 D2.2 arc(26.88,71.76) 27.13,72.37 ; U12.1 arc(26.57,67.94) 25.36,67.45 ; 27.13,72.37 U11.3 ; R24.2 25.36,67.45
$1N16309: length 11.1
  Top Layer w0.254: U1.1 91.31,47.5 90.42,46.61 86.11,46.61 85.31,47.4 U1.4 85.31,48.03 84.46,48.89 83.83,48.89 R34.2
$1N17027: length 1.8
  Top Layer w0.254: U15.1 98.84,56.06 98.79,56.01
$1N17621: length 2.8
  Top Layer w0.254: R29.1 71.74,67.75 Q1.1
$1N17824: length 9.2
  Top Layer w0.254: U23.2 69.72,76.96 72.03,74.66 D4.1 72.3,71.61 Q1.3
$1N17925: length 2.1
  Top Layer w0.254: R30.1 75.3,69.42 Q1.2
$1N18978: length 3.2
  Top Layer w0.254: 81.05,9.73 80.91,9.59 ; 81.05,9.73 U20.1 ; 81.05,9.73 81.18,9.59 82.56,9.59
$1N20279: length 3.9
  Top Layer w0.254: U1.5 83.31,48 82.54,48.78 81.79,48.78 R38.2
$1N20282: length 3.9
  Top Layer w0.254: U1.6 81.31,47.97 80.39,48.89 79.64,48.89 R39.2
$1N20285: length 3.9
  Top Layer w0.254: U1.7 79.31,47.94 78.36,48.89 77.61,48.89 R40.2
$1N20288: length 4.2
  Top Layer w0.254: R36.1 79.55,30.73 80.14,30.73 81.31,31.91 U1.17
$1N20291: length 4.1
  Top Layer w0.254: R37.1 76.57,29.58 77.85,30.86 78.1,30.86 79.31,32.07 U1.16
$1N20612: length 6.3
  Top Layer w0.254: R41.1 81.79,31.09 84.43,31.09 85.31,31.97 U1.19
$1N20651: length 6.4
  Top Layer w0.254: U1.20 87.31,31.94 86.11,30.73 83.35,30.73 R42.1
$1N21639: length 4.9
  Top Layer w0.254: R62.2 20.33,18.03 arc(20.05,18.14) 19.94,18.41 19.94,19.05 arc(19.79,19.41) 19.43,19.56 17.68,19.56 arc(17.43,19.46) U22.4
$1N21644: length 5.1
  Top Layer w0.254: R65.1 12.52,17.98 arc(12.83,18.11) 12.95,18.41 12.95,19.3 arc(13.1,19.66) 13.46,19.81 14.83,19.81 arc(15.26,19.64) U22.6
$1N21653: length 7.1
  Top Layer w0.254: R48.1 13.84,18.54 arc(13.95,18.27) 14.22,18.16 16.76,18.16 arc(17.12,18.01) 17.27,17.65 17.27,16.98 arc(17.29,16.94) U22.3 17.94,16.92 arc(18.1,16.99) 18.16,17.15 arc(18.22,17.3) 18.38,17.36 C20.2
$1N22004: length 2.2
  Top Layer w0.254: LED1.2 30.82,76.44 arc(30.85,76.38) R54.1
$1N22006: length 2.2
  Top Layer w0.254: R53.1 35.16,78.33 arc(35.12,78.44) U10.2

## Copper pours and planes (outline as drawn; the poured copper is in the pictures)
GND on Top Layer: -6.67,-37.02 -6.67,111.57 105.09,111.57 105.09,-37.02
GND on Bottom Layer: -17.78,84.07 133.48,84.07 133.48,-7.75 -17.78,-7.75
VBUS on Top Layer: 28.34,77.22 39.55,77.22 39.55,69 28.34,69
VBUS on Bottom Layer: 32.42,77.22 42.67,77.22 42.67,66.25 32.42,66.25
/TOUCH_PIN0 on Bottom Layer: 23.5,15.5 35.5,15.5 35.5,0.87 23.5,0.87
/TOUCH_PIN1 on Bottom Layer: 10,15.5 22,15.5 22,0.87 10,0.87

Small or netless copper shapes (teardrops, artwork), in the pictures only: 391 on Top Layer, 145 on Bottom Layer

## Text on the board
Bottom Silkscreen Layer: Design by / PAICL & 樂悅 | 常饮清泉 润泽心田 | 智能水杯垫V0.1 | ( ＾◡＾)っ ♨
